# EAGLE design GameboyCartridgeKS_Victory (EAGLE 9.5.2)
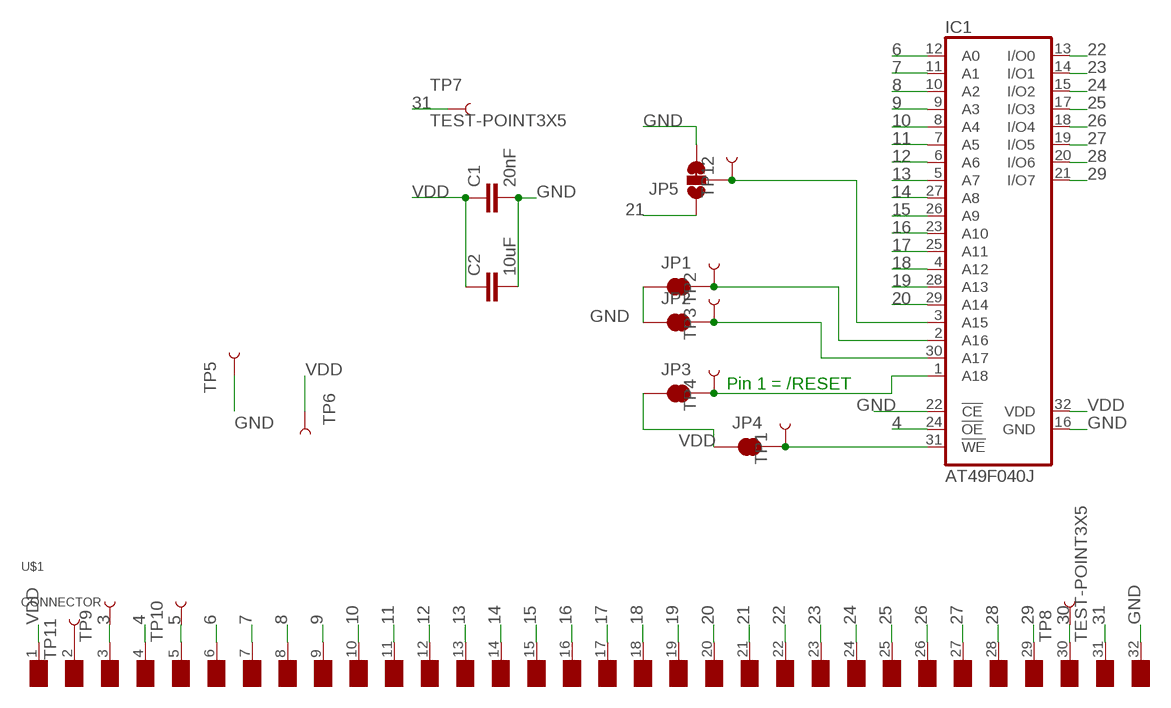
[diagram p0: schematic, sheet 1]

## Parts
C1  20nF  C-EUC0805  [C0805]
C2  10uF  10UF-1206-6.3V-20%  [1206]
IC1  AT49F040J  [PLCC32R]
JP1  JUMPER-SMT_2_NC_TRACE_SILK  [SMT-JUMPER_2_NC_TRACE_SILK]
JP2  JUMPER-SMT_2_NC_TRACE_SILK  [SMT-JUMPER_2_NC_TRACE_SILK]
JP3  JUMPER-SMT_2_NC_TRACE_SILK  [SMT-JUMPER_2_NC_TRACE_SILK]
JP4  JUMPER-SMT_2_NC_TRACE_SILK  [SMT-JUMPER_2_NC_TRACE_SILK]
JP5  JUMPER-SMT_3_1-NC_TRACE_SILK  [SMT-JUMPER_3_1-NC_TRACE_SILK]
TP1  TEST-POINT3X5  [PAD.03X.05]
TP2  TEST-POINT3X5  [PAD.03X.05]
TP3  TEST-POINT3X5  [PAD.03X.05]
TP4  TEST-POINT3X5  [PAD.03X.05]
TP5  TEST-POINT3X5  [PAD.03X.05]
TP6  TEST-POINT3X5  [PAD.03X.05]
TP7  TEST-POINT3X5  [PAD.03X.05]
TP8  TEST-POINT3X5  [PAD.03X.05]
TP9  TEST-POINT3X5  [PAD.03X.05]
TP10  TEST-POINT3X5  [PAD.03X.05]
TP11  TEST-POINT3X5  [PAD.03X.05]
TP12  TEST-POINT3X5  [PAD.03X.05]
U$1  CONNECTOR  [CONNECTOR]

## Nets
3: TP9.P$1 U$1.3(/WR)
4: IC1.24(!OE) U$1.4(/RD)
5: TP10.P$1 U$1.5(/RCS)
6: IC1.12(A0) U$1.6(A0)
7: IC1.11(A1) U$1.7(A1)
8: IC1.10(A2) U$1.8(A2)
9: IC1.9(A3) U$1.9(A3)
10: IC1.8(A4) U$1.10(A4)
11: IC1.7(A5) U$1.11(A5)
12: IC1.6(A6) U$1.12(A6)
13: IC1.5(A7) U$1.13(A7)
14: IC1.27(A8) U$1.14(A8)
15: IC1.26(A9) U$1.15(A9)
16: IC1.23(A10) U$1.16(A10)
17: IC1.25(A11) U$1.17(A11)
18: IC1.4(A12) U$1.18(A12)
19: IC1.28(A13) U$1.19(A13)
20: IC1.29(A14) U$1.20(A14)
21: JP5.1 U$1.21(A15)
22: IC1.13(I/O0) U$1.22(D0)
23: IC1.14(I/O1) U$1.23(D1)
24: IC1.15(I/O2) U$1.24(D2)
25: IC1.17(I/O3) U$1.25(D3)
26: IC1.18(I/O4) U$1.26(D4)
27: IC1.19(I/O5) U$1.27(D5)
28: IC1.20(I/O6) U$1.28(D6)
29: IC1.21(I/O7) U$1.29(D7)
30: TP8.P$1 U$1.30(/RS)
31: TP7.P$1 U$1.31(VIN)
GND: C1.2 C2.2 IC1.16(GND) IC1.22(!CE) JP1.1 JP2.1 JP5.3 TP5.P$1 U$1.32(GND)
N$1: IC1.31(!WE) JP4.2 TP1.P$1
N$2: TP11.P$1 U$1.2(NC)
N$3: IC1.3(A15) JP5.2 TP12.P$1
N$5: IC1.2(A16) JP1.2 TP2.P$1
N$6: IC1.30(A17) JP2.2 TP3.P$1
N$7: IC1.1(A18) JP3.2 TP4.P$1
VDD: C1.1 C2.1 IC1.32(VDD) JP3.1 JP4.1 TP6.P$1 U$1.1(VDD)

## Notes on the sheet
- Pin 1 = /RESET

## Library data of the parts
C1 = resistor:C-EU: CAPACITOR, European symbol
C2 = SparkFun-Capacitors:10UF: 10.0µF ceramic capacitors A capacitor is a passive two-terminal electrical component used to store electrical energy temporarily in an electric field.; PROD_ID: CAP-10057
IC1 = gameboy:AT49F040J: 4-Megabit FLASH MEMORY (512 K x 8 bit) 5 V-only
JP1-JP4 = SparkFun-Jumpers:JUMPER-SMT_2_NC_TRACE: Normally closed trace jumper This jumper has a trace between two pads so it's normally closed (NC). Use a razor knife to open the connection. For best results follow the IPC guidelines for cutting traces: Cutout at least 0.063 mm (0.005 in). Remove all loose material to clean up the cut area. Seal the cut with an approved epoxy. Reapply solder to reclose the connection.
JP5 = SparkFun-Jumpers:JUMPER-SMT_3_1-NC_TRACE: Normally closed trace jumper (1 of 2 connections) This jumper has a trace between two pads so it's normally closed (NC). The other connection is normally open (NO). Use a razor knife to open the connection. For best results follow the IPC guidelines for cutting traces: Cutout at least 0.063 mm (0.005 in). Remove all loose material to clean up the cut area. Seal the cut with an approved epoxy. Reapply solder to reclose the connection, or to close the NO connection.
TP1-TP12 = SparkFun-Connectors:TEST-POINT: SparkFun Test Points Bare copper test points for troubleshooting or In-Circuit-Testing. These are used by our Production team for verifying production board runs using pogo-pins on test beds. SparkFun Products: SparkFun LSM9DS1 Breakout <https://www.sparkfun.com/products/13284> SparkFun PSOC <https://www.sparkfun.com/products/13714> SparkFun Load Cell Amplifier <https://www.sparkfun.com/products/13879>
U$1 = gameboy:CONNECTOR: Connector Pads for Gameboy Cartridges

## Board
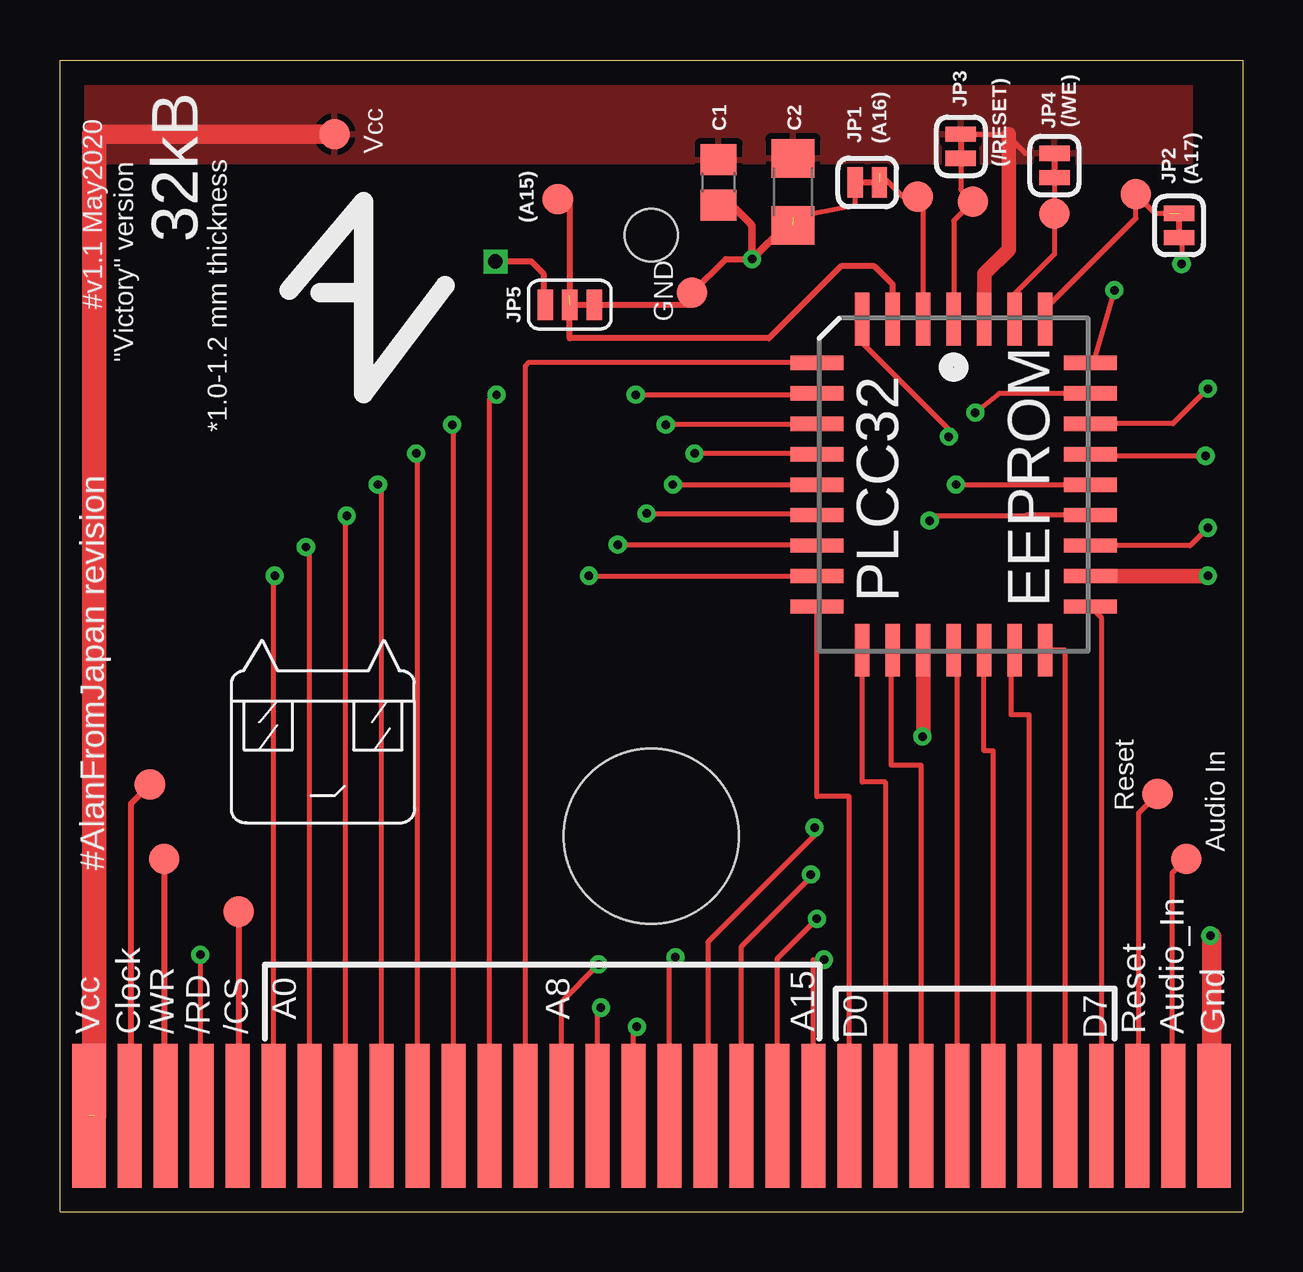
[diagram p1: board, top side]
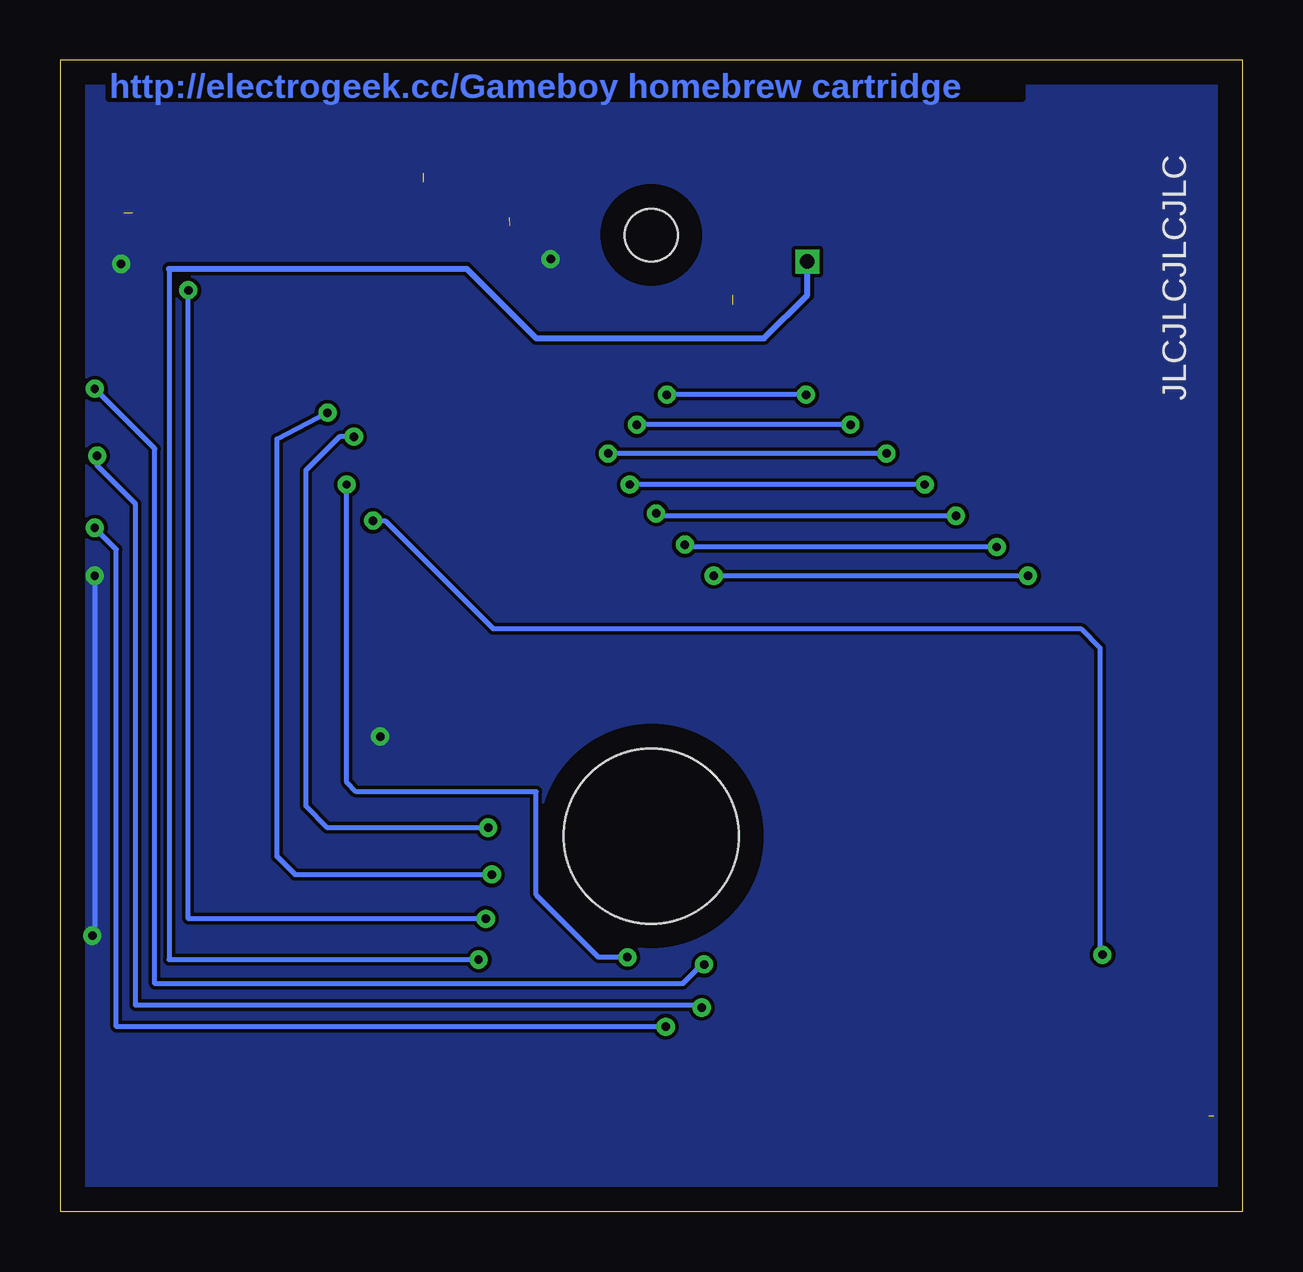
[diagram p2: board, bottom side, seen from below]

Size 49.3 x 48 mm. Coordinates in mm from the lower left corner, seen from the top.
Outline: 49.3,48 49.3,0 0,0 0,48 49.3,48
Copper layers (1*16): Top 0.035mm / dielectric 1.5mm / Bottom 0.035mm
Design rules "default": minimum track width 6mil, minimum drill 0.35mm, track to track 6mil, track to pad 6mil, pad to pad 6mil, via to via 6mil, smd to smd 6mil, copper to edge 40mil, drill to drill 6mil, minimum pad ring 10mil, minimum via ring 8mil, stop-mask expansion 4mil, vias tented up to drill 0mil, thermal gap 10mil
Holes 7.3 mm at 24.65,15.65
Holes 2.2 mm at 24.65,40.7

### Footprints (pad centres in the part's own frame; a part is rotated, then mirrored left to right if it is on the bottom)
C0805 = smd 1.3 x 1.5: 1 -0.95,0; 2 0.95,0
1206 = smd 1.6 x 1.8: 1 -1.4,0; 2 1.4,0
PLCC32R = smd 0.6 x 2.2: 1 0,6.9; 2 -1.27,6.9; 3 -2.54,6.9; 4 -3.81,6.9; 14 -3.81,-6.9; 15 -2.54,-6.9; 16 -1.27,-6.9; 17 0,-6.9; 18 1.27,-6.9; 19 2.54,-6.9; 20 3.81,-6.9; 30 3.81,6.9; 31 2.54,6.9; 32 1.27,6.9 | smd 2.2 x 0.6: 5 -5.7,5.08; 6 -5.7,3.81; 7 -5.7,2.54; 8 -5.7,1.27; 9 -5.7,0; 10 -5.7,-1.27; 11 -5.7,-2.54; 12 -5.7,-3.81; 13 -5.7,-5.08; 21 5.7,-5.08; 22 5.7,-3.81; 23 5.7,-2.54; 24 5.7,-1.27; 25 5.7,0; 26 5.7,1.27; 27 5.7,2.54; 28 5.7,3.81; 29 5.7,5.08
SMT-JUMPER_2_NC_TRACE_SILK = smd 0.635 x 1.27: 1 -0.508,0; 2 0.508,0
SMT-JUMPER_3_1-NC_TRACE_SILK = smd 0.635 x 1.27: 1 -1.016,0; 2 0,0; 3 1.016,0
PAD.03X.05 = smd 1.27 x 1.27: P$1 0,0
CONNECTOR = smd 1.4 x 6: 1 0.7,-3; 32 47.6,-3 | smd 1 x 6: 2 2.4,-3; 3 3.9,-3; 4 5.4,-3; 5 6.9,-3; 6 8.4,-3; 7 9.9,-3; 8 11.4,-3; 9 12.9,-3; 10 14.4,-3; 11 15.9,-3; 12 17.4,-3; 13 18.9,-3; 14 20.4,-3; 15 21.9,-3; 16 23.4,-3; 17 24.9,-3; 18 26.4,-3; 19 27.9,-3; 20 29.4,-3; 21 30.9,-3; 22 32.4,-3; 23 33.9,-3; 24 35.4,-3; 25 36.9,-3; 26 38.4,-3; 27 39.9,-3; 28 41.4,-3; 29 42.9,-3; 30 44.4,-3; 31 45.9,-3

### Placement (x,y rotation side)
C1  27.45,42.9 270 top
C2  30.55,42.5 270 top
IC1  37.25,30.3 0 top
JP1  33.65,42.9 0 top
JP2  46.65,41.1 90 top
JP3  37.55,44.4 270 top
JP4  41.45,43.6 270 top
JP5  21.25,37.8 0 top
TP1  41.45,41.6 270 top
TP2  35.75,42.3 0 top
TP3  44.85,42.4 0 top
TP4  38.05,42.1 270 top
TP5  26.35,38.3 0 top
TP6  11.45,44.9 0 top
TP7  46.95,14.7 0 top
TP8  45.75,17.4 0 top
TP9  4.35,14.7 0 top
TP10  7.45,12.5 0 top
TP11  3.75,17.8 0 top
TP12  20.75,42.2 0 top
U$1  0.5,7 0 top
U$2  [GAMEBOY_LOGO]  20.35,21 0 top
U$3  [PIGMAN1]  7.15,16.2 0 top

### Tracks (layer width: path | path; a pad name or v marks a point on that pad's centre or on a via)
3
  Top 0.254: TP9.P$1 4.35,4.05 U$1.3
4  (via drill 0.35)
  Top 0.2: IC1.24 40.28,29.03 40.25,29 36.45,29 v36.25,28.8 | v5.85,10.7 5.85,4.05 U$1.4
  Bottom 0.2: v36.25,28.8 35.75,28.8 31.25,24.3 6.75,24.3 5.95,23.5 5.95,10.8 v5.85,10.7
5
  Top 0.254: TP10.P$1 7.45,4.05 U$1.5
6  (via drill 0.35)
  Top 0.2: U$1.6 8.9,26.45 v8.95,26.5 | v22.05,26.5 IC1.12
  Bottom 0.2: v8.95,26.5 v22.05,26.5
7  (via drill 0.35)
  Top 0.2: U$1.7 10.4,27.55 v10.25,27.7 | v23.25,27.8 31.51,27.8 IC1.11
  Bottom 0.2: v10.25,27.7 23.15,27.7 v23.25,27.8
8  (via drill 0.35)
  Top 0.152: U$1.8 11.97,4.07
  Top 0.2: U$1.8 11.9,28.95 v11.95,29 | v24.45,29.1 31.48,29.1 IC1.10
  Bottom 0.2: v11.95,29 24.35,29 v24.45,29.1
9  (via drill 0.35)
  Top 0.2: U$1.9 13.4,30.15 v13.25,30.3 | v25.55,30.3 IC1.9
  Bottom 0.2: v13.25,30.3 v25.55,30.3
10  (via drill 0.35)
  Top 0.2: U$1.10 14.9,31.55 v14.85,31.6 | IC1.8 31.52,31.6 v26.45,31.6
  Bottom 0.2: v14.85,31.6 v26.45,31.6
11  (via drill 0.35)
  Top 0.2: U$1.11 16.4,32.75 v16.35,32.8 | IC1.7 31.51,32.8 v25.25,32.8
  Bottom 0.2: v16.35,32.8 v25.25,32.8
12  (via drill 0.35)
  Top 0.2: U$1.12 17.9,33.85 18.15,34.1 v18.2,34.05 | v24,34.05 31.49,34.05 IC1.6
  Bottom 0.2: v18.2,34.05 v24,34.05
13
  Top 0.152: U$1.13 19.25,4.15
  Top 0.2: U$1.13 19.4,35.25 19.55,35.4 31.53,35.4 IC1.5
14  (via drill 0.35)
  Top 0.2: U$1.14 20.9,8.75 v22.45,10.3 | v47.85,34.3 46.39,32.84 IC1.27
  Bottom 0.2: v22.45,10.3 22.55,10.3 23.35,9.5 45.35,9.5 45.35,31.8 v47.85,34.3
15  (via drill 0.35)
  Top 0.2: U$1.15 22.4,8.35 v22.55,8.5 | v47.75,31.5 43.02,31.5 IC1.26
  Bottom 0.2: v22.55,8.5 22.65,8.6 46.15,8.6 46.15,29.5 47.75,31.1 v47.75,31.5
16  (via drill 0.35)
  Top 0.2: U$1.16 23.9,7.55 v24.05,7.7 | v47.85,28.5 47.11,27.76 IC1.23
  Bottom 0.2: v24.05,7.7 46.95,7.7 46.95,27.6 v47.85,28.5
17  (via drill 0.35)
  Top 0.2: U$1.17 25.4,10.35 v25.65,10.6 | v37.35,30.3 IC1.25
  Bottom 0.2: v25.65,10.6 26.85,10.6 29.45,13.2 29.45,17.5 36.95,17.5 37.35,17.9 v37.35,30.3
18  (via drill 0.35)
  Top 0.2: U$1.18 27,4.1 27,11.24 31.45,15.69 v31.45,16 | v37.05,32.3 37.05,32.6 33.35,36.3 33.35,37.11 IC1.4
  Bottom 0.2: v31.45,16 38.15,16 39.05,16.9 39.05,30.9 37.65,32.3 v37.05,32.3
19  (via drill 0.35)
  Top 0.152: U$1.19 28.35,4.05
  Top 0.2: U$1.19 28.4,11.05 31.3,13.95 v31.3,14.05 | IC1.28 39.15,34.1 v38.15,33.3
  Bottom 0.2: v31.3,14.05 39.5,14.05 40.25,14.8 40.25,32.2 v38.15,33.3
20  (via drill 0.35)
  Top 0.2: U$1.20 29.9,10.55 v31.55,12.2 | IC1.29 43.12,35.55 v43.95,38.4
  Bottom 0.2: v43.95,38.4 43.95,12.2 v31.55,12.2
21  (via drill 0.35, 0.6)
  Top 0.2: U$1.21 31.4,10.5 v31.85,10.5
  Top 0.254: JP5.1 20.15,37.88 20.15,39.1 19.65,39.6 v18.15,39.6
  Bottom 0.2: v31.85,10.5 44.75,10.5 44.75,39.3
  Bottom 0.254: 44.75,39.3 32.35,39.3 29.45,36.4 19.95,36.4 18.15,38.2 v18.15,39.6
22
  Top 0.2: U$1.22 32.9,17.3 31.55,17.3 IC1.13
23
  Top 0.2: U$1.23 34.4,17.9 33.44,17.9 IC1.14
24
  Top 0.152: 35.95,4.05 U$1.24
  Top 0.2: U$1.24 35.9,18.6 34.65,18.6 34.65,23.4 IC1.15
25
  Top 0.152: 37.25,4.15 U$1.25
  Top 0.2: U$1.25 37.4,23.4 IC1.17
26
  Top 0.2: U$1.26 38.9,19.2 38.52,19.2 IC1.18
27
  Top 0.2: U$1.27 40.4,20.7 39.65,20.7 39.65,23.4 IC1.19
28
  Top 0.152: 41.83,4 U$1.28
  Top 0.2: U$1.28 41.9,23.4 IC1.20
29
  Top 0.2: IC1.21 | IC1.21 | IC1.21 43.4,24.77 U$1.29 | U$1.29 | U$1.29
30
  Top 0.152: U$1.30 45.1,4.2
  Top 0.2: TP8.P$1 44.95,16.6 44.95,4.05 U$1.30
31
  Top 0.152: U$1.31 46.45,4.05
  Top 0.2: TP7.P$1 46.35,14.1 46.35,4.05 U$1.31
GND  (via drill 0.35)  (1 unrouted)
  Top 0.152: U$1.32 48.15,4.05
  Top 0.2: v47.95,11.5 48,11.45 | U$1.32 48,4.1 | IC1.22 | JP2.1 46.75,40.49 v46.75,39.5 | JP1.1 33.14,41.92 30.57,41.42 | TP5.P$1 27.45,39.4 | C1.2 28,41.95 | 28.75,41.1 28.8,41.15 28.85,41.1 | 35.98,19.83 v35.95,19.8 | 30.25,41.1 C2.2
  Top 0.254: JP5.3 26.35,37.8 TP5.P$1 27.75,39.7 v28.85,39.7
  Top 0.305: 28.8,41.15 28,41.95 | 30.25,41.1 v28.85,39.7 28.85,41.1
  Top 0.61: v47.85,26.5 IC1.22 | IC1.16 35.98,19.83
  Top 0.813: 48,11.45 48,4.1
  Bottom 0.2: v47.95,11.5 47.85,11.6 v47.85,26.5
  pour Bottom: 0.15,47.9 49.15,47.9 49.15,0.1 0.15,0.1
N$1
  Top 0.2: JP4.2 TP1.P$1 41.45,39.9 39.79,38.24 IC1.31
N$2
  Top 0.254: TP11.P$1 2.95,17 2.95,4.05 U$1.2
N$3  (2 unrouted)
  Top 0.254: IC1.3 34.71,38.64 33.95,39.4 32.55,39.4 29.55,36.4 21.24,36.4 JP5.2 | TP12.P$1 21.05,42.2 21.24,42.01 21.24,38.2
N$5  (1 unrouted)
  Top 0.2: IC1.2 35.98,42.07 TP2.P$1 35.14,42.3 34.16,43.28
N$6  (1 unrouted)
  Top 0.2: IC1.30 41.06,37.61 44.85,41.4 TP3.P$1 45.64,41.61 46.27,41.61
N$7
  Top 0.2: JP3.2 37.55,42.6 TP4.P$1 37.25,41.3 IC1.1
VDD  (1 unrouted)
  Top 0.2: JP4.1 41.35,44.01 | 38.34,37.38 IC1.32 38.53,37.19 | 40.25,44.1 39.44,44.91 JP3.1 39.55,44.91
  Top 0.61: 38.53,37.19 38.53,39.09 39.55,40.1 39.55,44.91
  Top 0.813: TP6.P$1 1.42,44.9
  Top 1.016: 1.42,44.9 1.42,4
  pour Top: 0.15,8.2 0.15,47.9 47.15,47.9 47.15,43.7 1.85,43.7 1.85,8.2

### Text on the board
Bottom: http://electrogeek.cc/Gameboy homebrew cartridge
tPlace: (A16) | (/WE) | (/RESET) | Vcc | (A17) | (A15) | 32kB | #v1.1 May2020 | GND | "Victory" version | *1.0-1.2 mm thickness | Reset | Audio In | #AlanFromJapan revision | A0 | A8 | A15 | Vcc | Clock | /WR | /RD | /CS | D0 | D7 | Reset | Audio_In | Gnd
bPlace: JLCJLCJLCJLC
tNames: PLCC32 | EEPROM